# Altium schematic sheet UI.SchDoc
size A4
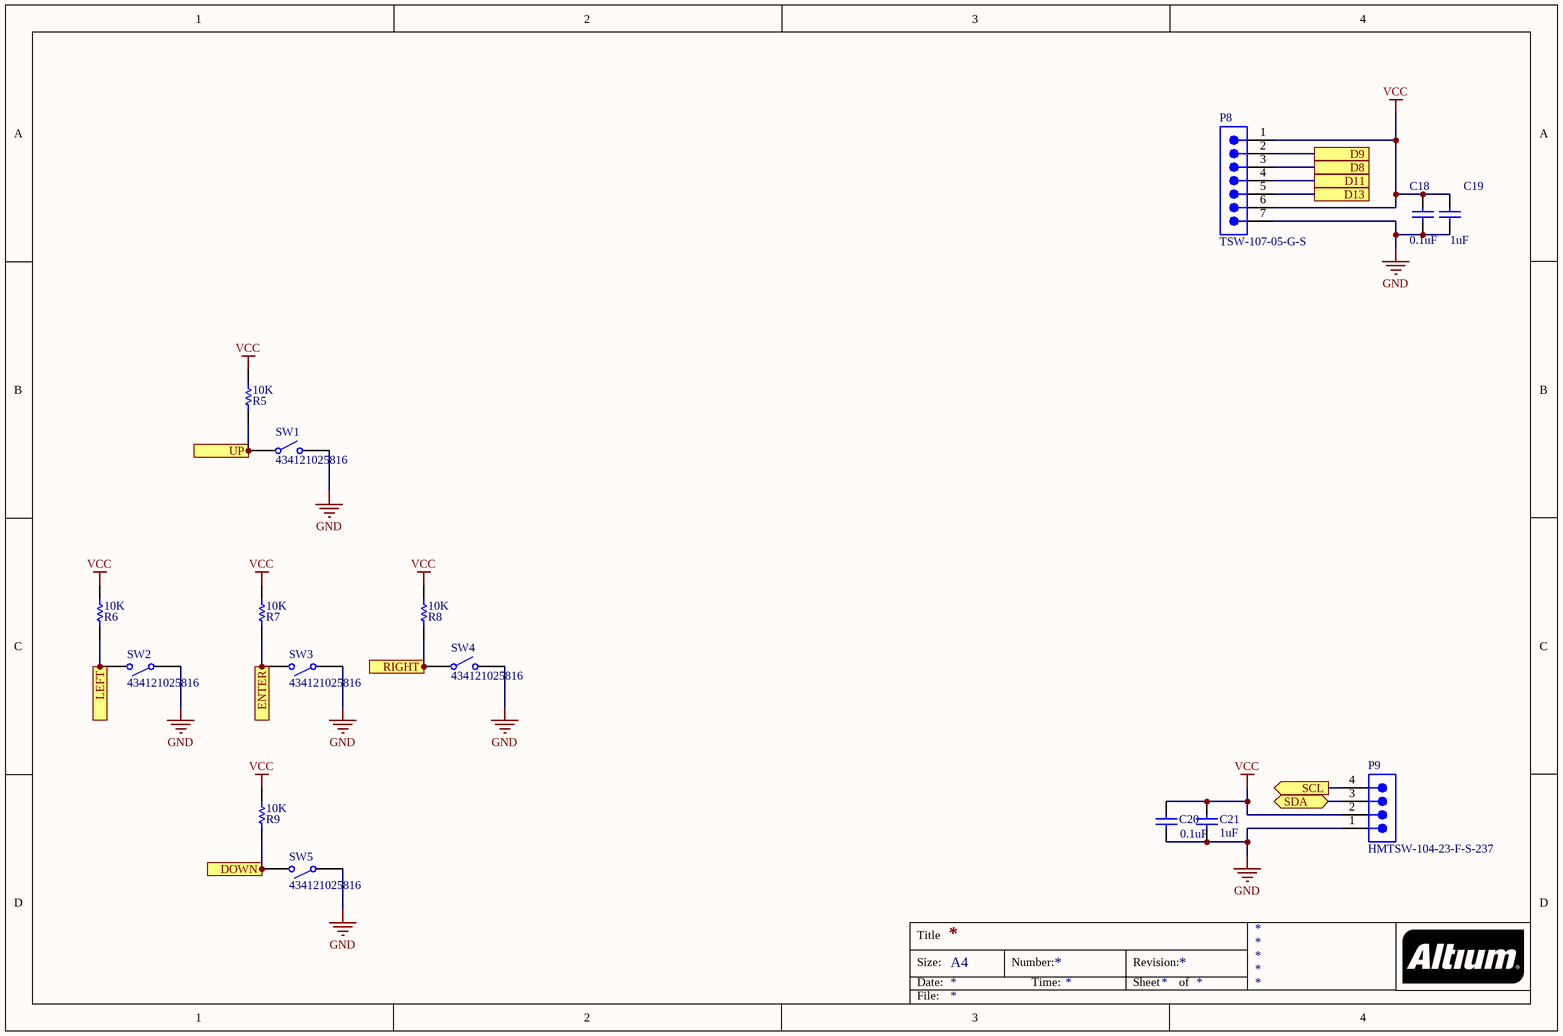
[diagram p0: UI.SchDoc]

## Parts
C18  0.1uF  [CAPC0603(1608)100_M]
C19  1uF  [CAPC0603(1608)100_M]
C20  0.1uF  [CAPC0603(1608)100_M]
C21  1uF  [CAPC0603(1608)100_M]
P8  TSW-107-05-G-S  [SMTC-TSW-107-05-X-S]
P9  HMTSW-104-23-F-S-237  [SMTC-HMTSW-104-23-X-S-237]
R5  10K  [RESC1608X55X25ML10T15]
R6  10K  [RESC1608X55X25ML10T15]
R7  10K  [RESC1608X55X25ML10T15]
R8  10K  [RESC1608X55X25ML10T15]
R9  10K  [RESC1608X55X25ML10T15]
SW1  434121025816  [434121025816]
SW2  434121025816  [434121025816]
SW3  434121025816  [434121025816]
SW4  434121025816  [434121025816]
SW5  434121025816  [434121025816]

## Ports
D8, D9, D11, D13, DOWN, ENTER, LEFT, RIGHT, SCL (out), SDA (bidir), UP

## Nets
GND: C18.2 C19.2 C20.2 C21.2 P8.7 P9.1 SW1.2 SW2.1 SW3.1 SW4.2 SW5.1
VCC: C18.1 C19.1 C20.1 C21.1 P8.1 P8.6 P9.2 R5.2 R6.2 R7.2 R8.2 R9.2
D8: P8.3 ; port D8
D9: P8.2 ; port D9
D11: P8.4 ; port D11
D13: P8.5 ; port D13
DOWN: R9.1 SW5.2 ; port DOWN
ENTER: R7.1 SW3.2 ; port ENTER
LEFT: R6.1 SW2.2 ; port LEFT
RIGHT: R8.1 SW4.1 ; port RIGHT
SCL: P9.4 ; port SCL
SDA: P9.3 ; port SDA
UP: R5.1 SW1.1 ; port UP

## Notes on the sheet
- Title
- Size:
- Date:
- A4
- Number:
- Time:
- Revision:
- Sheet
- of
- File:

## Library data of the parts
C18-C21 = CMP-1035-00774-1: CAP 20pF 25V ±0.25pF 0603 (1608 Metric) Thickness 1mm SMD; Case-EIA: 0603; Tolerance: Â±0.25pF; Case-Metric: 1608; Max Thickness: 1 mm; Rated Voltage: 25 V; Technology: SMT; Value: 20pF
P8 = CMP-1024-00400-1: 0.025" SQ Post Header, Through-hole, Vertical, -55 to 125 degC, 2.54 mm Pitch, 7-Pin, Male, RoHS; Manufacturer: Samtec; Pitch: 2.54 mm; PackageReference: TSW-107-05-X-S; Orientation: Vertical; ComponentLink2Description: Datasheet; Mounting Technology: Through-hole; PackageDescription: .025[0.64] SQ. Post Terminal Strip Assembly; PackageVersion: DM, 8/1988; RoHS: True; ComponentLink1Description: Manufacturer URL; ComponentLink2URL: http://www.samtec.com/documents/webfiles/pdf/TSW_TH.PDF; PartNumber: TSW-107-05-G-S; DatasheetVersion: F-214; ComponentLink3URL: http://www.samtec.com/documents/webfiles/cpdf/TSW-XXX-XX-XXX-X-XX-XXX-MKT.pdf; ComponentLink1URL: http://www.samtec.com; ComponentLink3Description: Package Specification; Temperature Range: -55 to 125 degC
P9 = CMP-1024-00021-1: Modified .025" SQ Post Header, Through-hole, Vertical, -55 to 125 degC, 2.54 mm Pitch, 4-Pin, Male, RoHS; Manufacturer: Samtec; Pitch: 2.54 mm; PackageReference: HMTSW-104-23-X-S-237; ComponentLink2URL: http://www.samtec.com/documents/webfiles/pdf/HMTSW.PDF; ComponentLink3Description: Package Specification; PartNumber: HMTSW-104-23-F-S-237; RoHS: True; ComponentLink2Description: Datasheet; Temperature Range: -55 to 125 degC; ComponentLink1Description: Manufacturer URL; DatasheetVersion: F-214; PackageDescription: Assembly .025 [.64] SQ. Post Hi-Temp Terminal Strip; Orientation: Vertical; PackageVersion: AL, 3/1987; Mounting Technology: Through-hole; ComponentLink1URL: http://www.samtec.com; ComponentLink3URL: http://www.samtec.com/documents/webfiles/cpdf/HMTSW-XXX-XX-X-X-XXXX-XX-XX-MKT1.pdf
R5-R9 = CMP-2000-05024-1: Chip Resistor, 4.7 KOhm, +/- 5%, 100 mW, -55 to 155 degC, 0603 (1608 Metric), RoHS, Tape and Reel; Manufacturer: Yageo; Resistance: 4.7kOhms; Temperature Coefficient: 100PPM/C; Power Rating: 100mW; Voltage Rating: 50V; Operating Temperature Range: -55Cto+155C; Case Code - mm: 1608; Tolerance: 5%; Product: ThickFilmResistorsGeneralPurpose; Case Code - in: 0603; Datasheet URL: http://www.yageo.com/documents/recent/PYu-RC_Group_51_RoHS_L_04.pdf; Package Reference: 603; Datasheet Version: Rev. 4, 02/2016; Package Description: 2-Pin Surface Mount Device, Body 1.6 x 0.8 mm; Manufacturer URL: http://www.yageo.com/; Series: RC; Packaging: Reel; Termination Style: SMD/SMT
SW1-SW5 = CMP-1459-00004-1: WS-TASV SMD Tact Switch 6.0X3.8 mm; Manufacturer: Wuerth Elektronik; NoPins: 02; PackageReference: 434121025816; ComponentLink2URL: http://katalog.we-online.de/em/datasheet/434121025816.pdf; PartNumber: 434121025816; ComponentLink2Description: Datasheet; ComponentLink1URL: http://www.we-online.com; ComponentLink1Description: Manufacturer URL